# Altium schematic sheet 02-REVISION HISTORY.SchDoc
size 513 x 386 mm
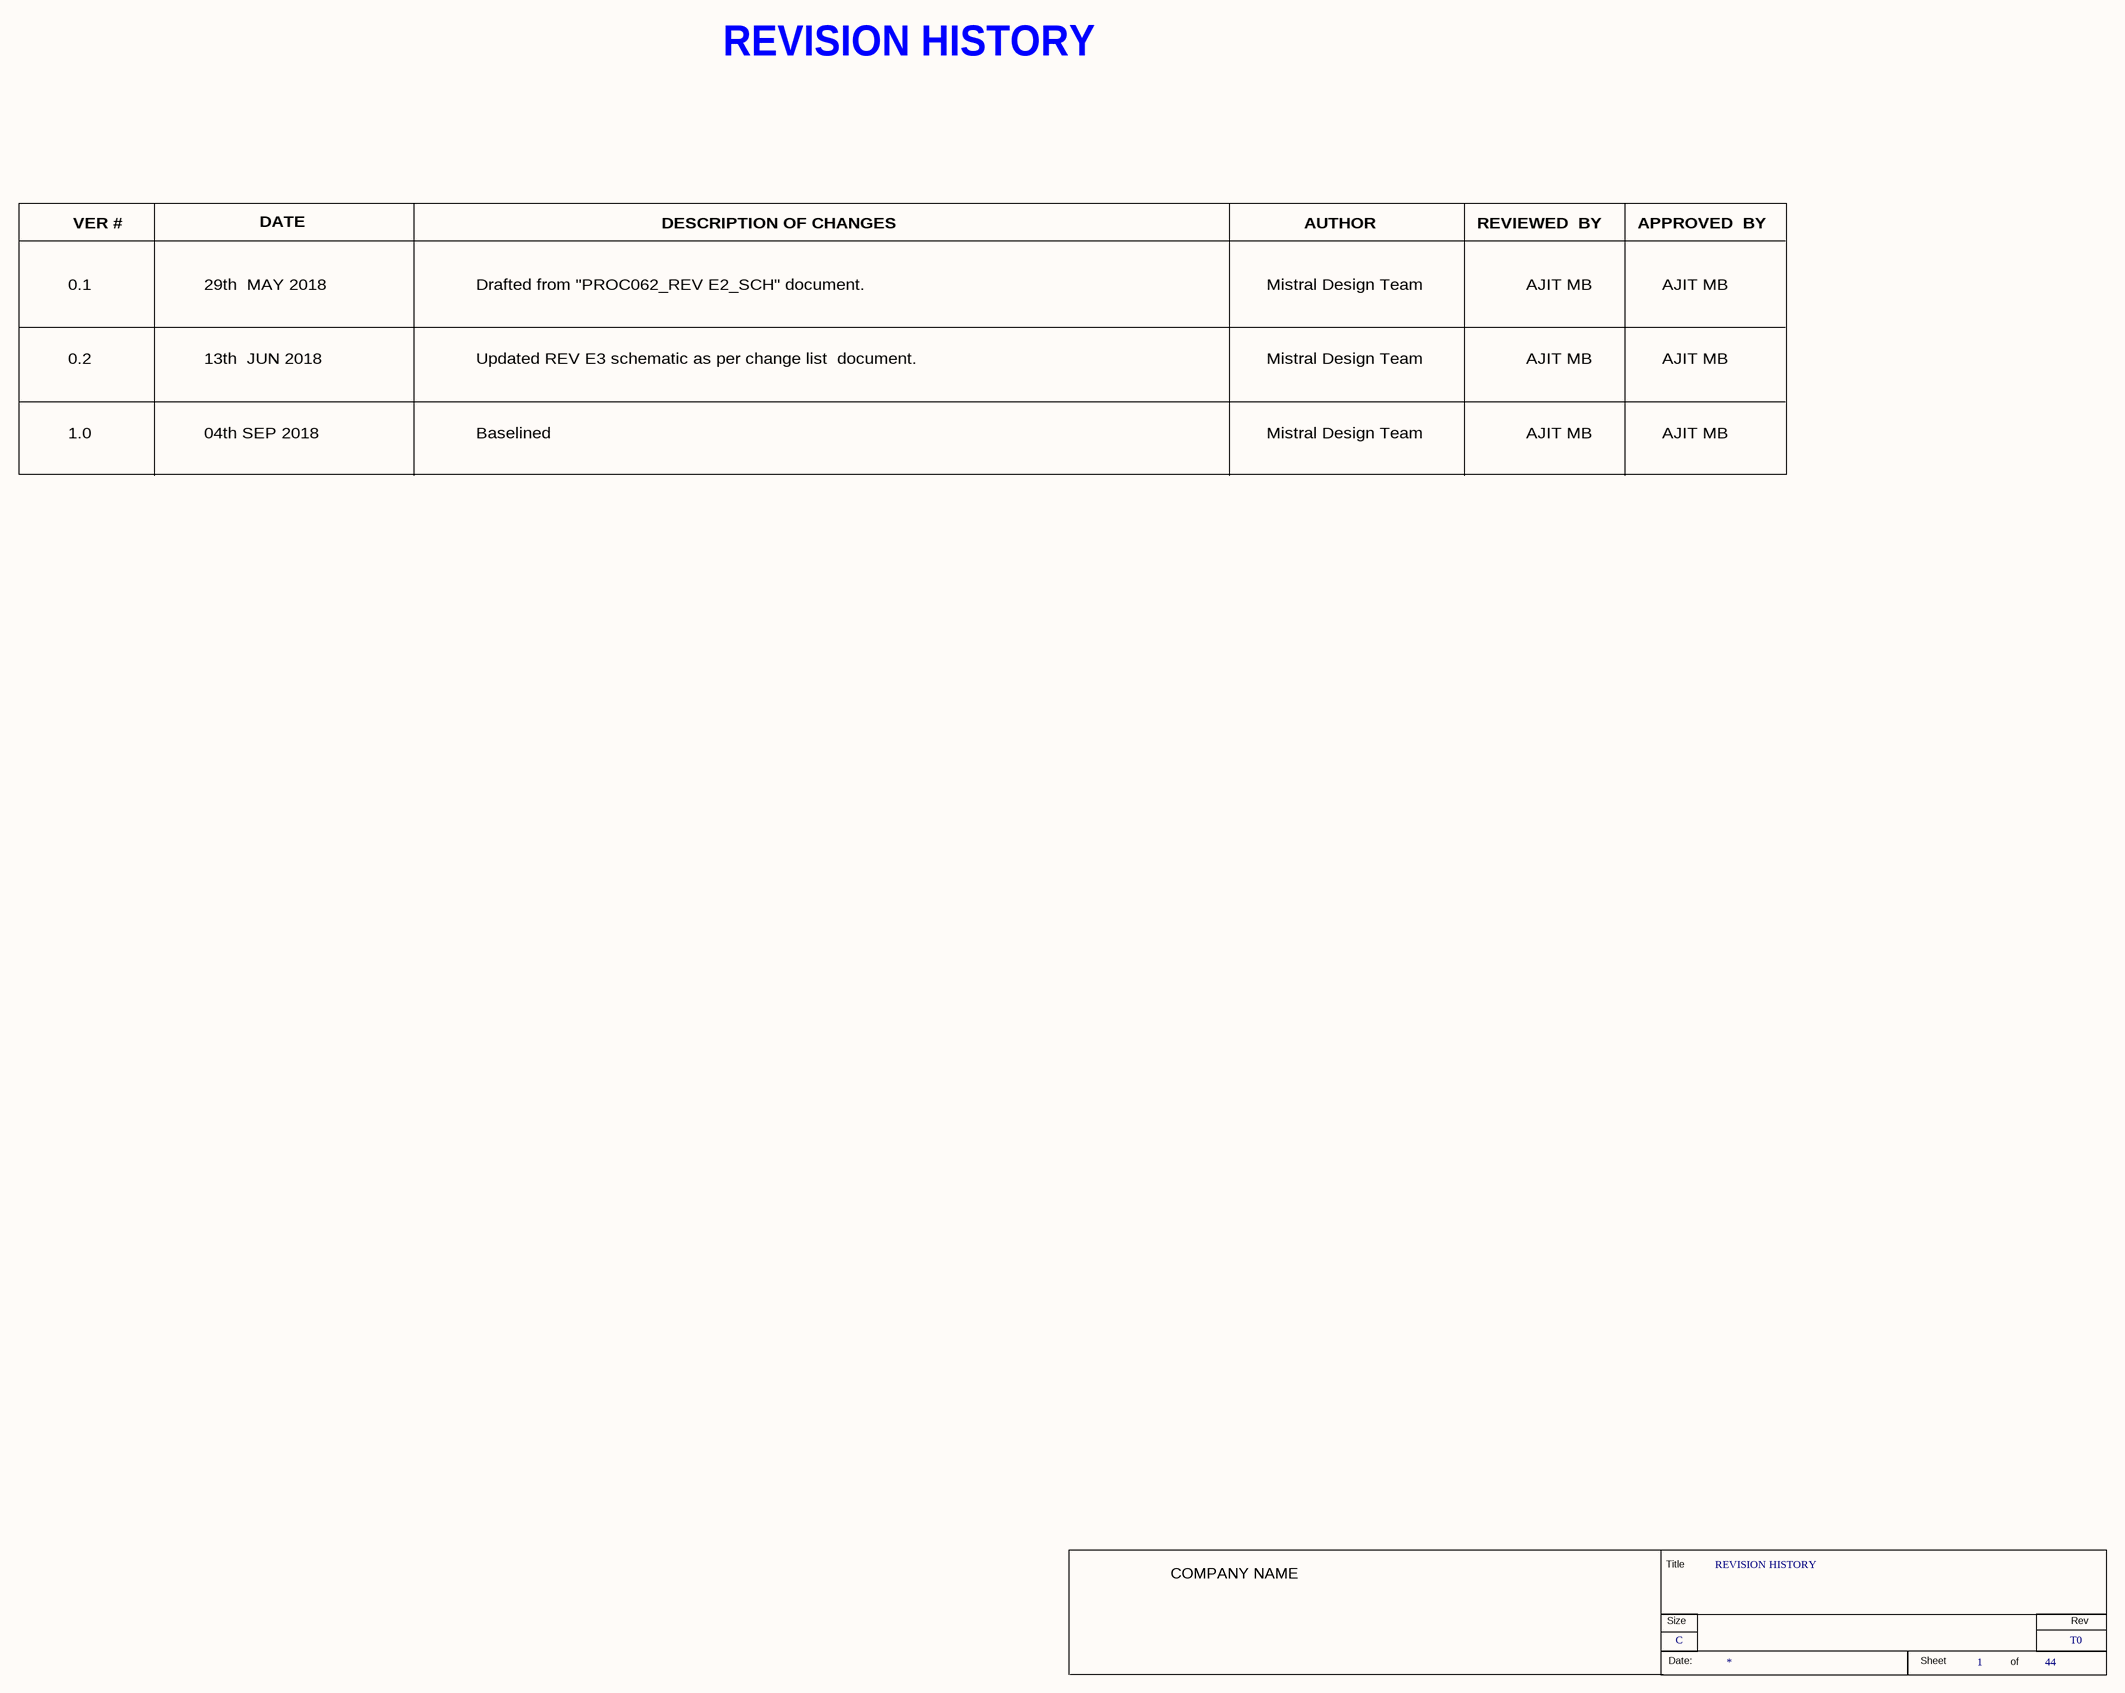
[diagram p0: 02-REVISION HISTORY.SchDoc]

## Parts
*  RevCode: T0  Title: REVISION HISTORY  Page Size: C  Page Number: 1  Page Count: 44  (hidden comment: TRAINING_TITLEBLK_CSIZE)  (graphical)

## Notes on the sheet
- REVISION HISTORY
- VER #
- DATE
- DESCRIPTION OF CHANGES
- AUTHOR
- REVIEWED  BY
- APPROVED  BY
- 0.1
- 29th  MAY 2018
- Drafted from "PROC062_REV E2_SCH" document.
- Mistral Design Team
- AJIT MB
- 0.2
- 13th  JUN 2018
- Updated REV E3 schematic as per change list  document.
- 1.0
- 04th SEP 2018
- Baselined
- (in symbol TRAINING_TITLEBLK_CSIZE) Title; COMPANY NAME; Size; Rev; Date:; Sheet; of

## Library data of the parts
* = TRAINING_TITLEBLK_CSIZE: Issue: 1.0; Page Create Date: Jan  8, 2022; Page Modify Date: *